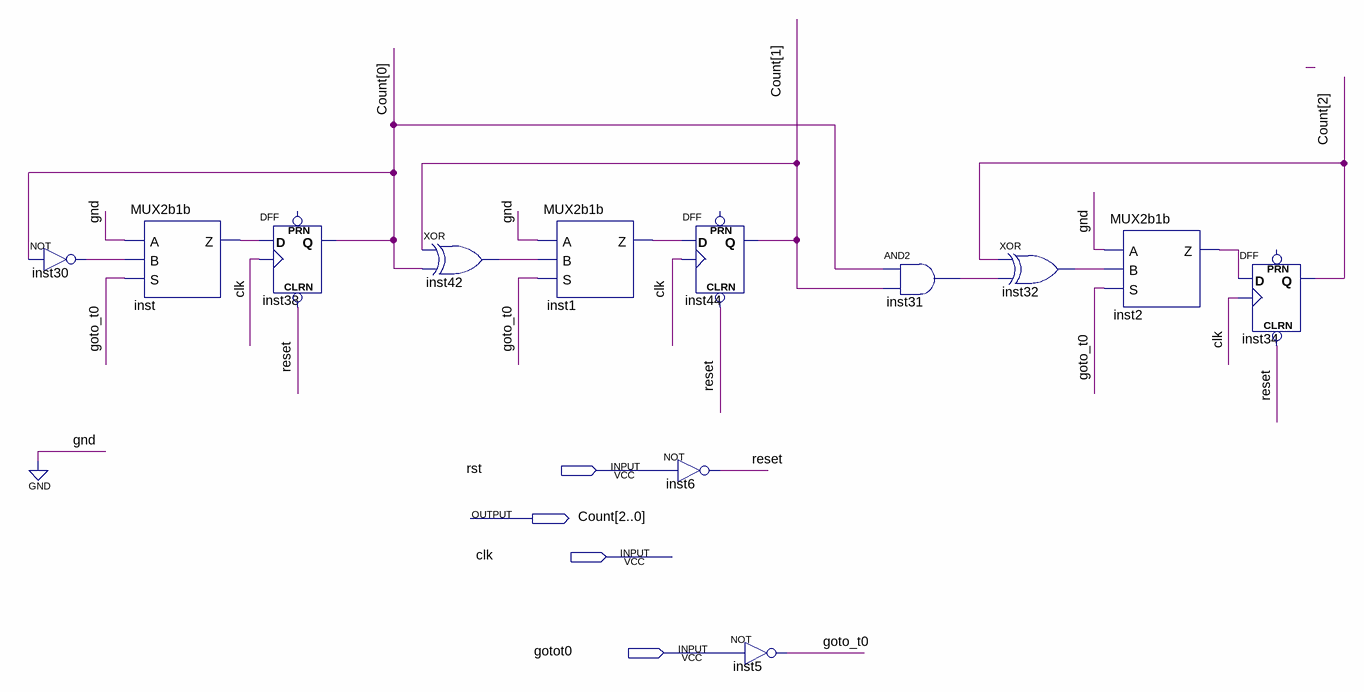
[diagram p0: schematic sheet]
// Quartus schematic CONT3b.bdf as structural Verilog: 12 symbols, 4 pins
module CONT3b (
  input  rst,
  input  clk,
  input  gotot0,
  output [2:0] Count
);

  wire goto_t0, inst1_z, inst2_z, inst30_out, inst31_out, inst32_out, inst42_out, inst_z, reset;

  not inst30 (inst30_out, Count[0]);
  MUX2b1b inst (.A(1'b0), .B(inst30_out), .S(goto_t0), .Z(inst_z));
  DFF inst38 (.CLRN(reset), .CLK(clk), .D(inst_z), .Q(Count[0]));  // open: PRN
  xor inst42 (inst42_out, Count[1], Count[0]);
  MUX2b1b inst1 (.A(1'b0), .B(inst42_out), .S(goto_t0), .Z(inst1_z));
  DFF inst44 (.CLRN(reset), .CLK(clk), .D(inst1_z), .Q(Count[1]));  // open: PRN
  not inst6 (reset, rst);
  not inst5 (goto_t0, gotot0);
  and inst31 (inst31_out, Count[0], Count[1]);
  xor inst32 (inst32_out, Count[2], inst31_out);
  MUX2b1b inst2 (.A(1'b0), .B(inst32_out), .S(goto_t0), .Z(inst2_z));
  DFF inst34 (.CLRN(reset), .CLK(clk), .D(inst2_z), .Q(Count[2]));  // open: PRN
endmodule
